# Altium schematic sheet TurboSpin.SchDoc
size A4; SheetNumber: 1; SheetTotal: 9
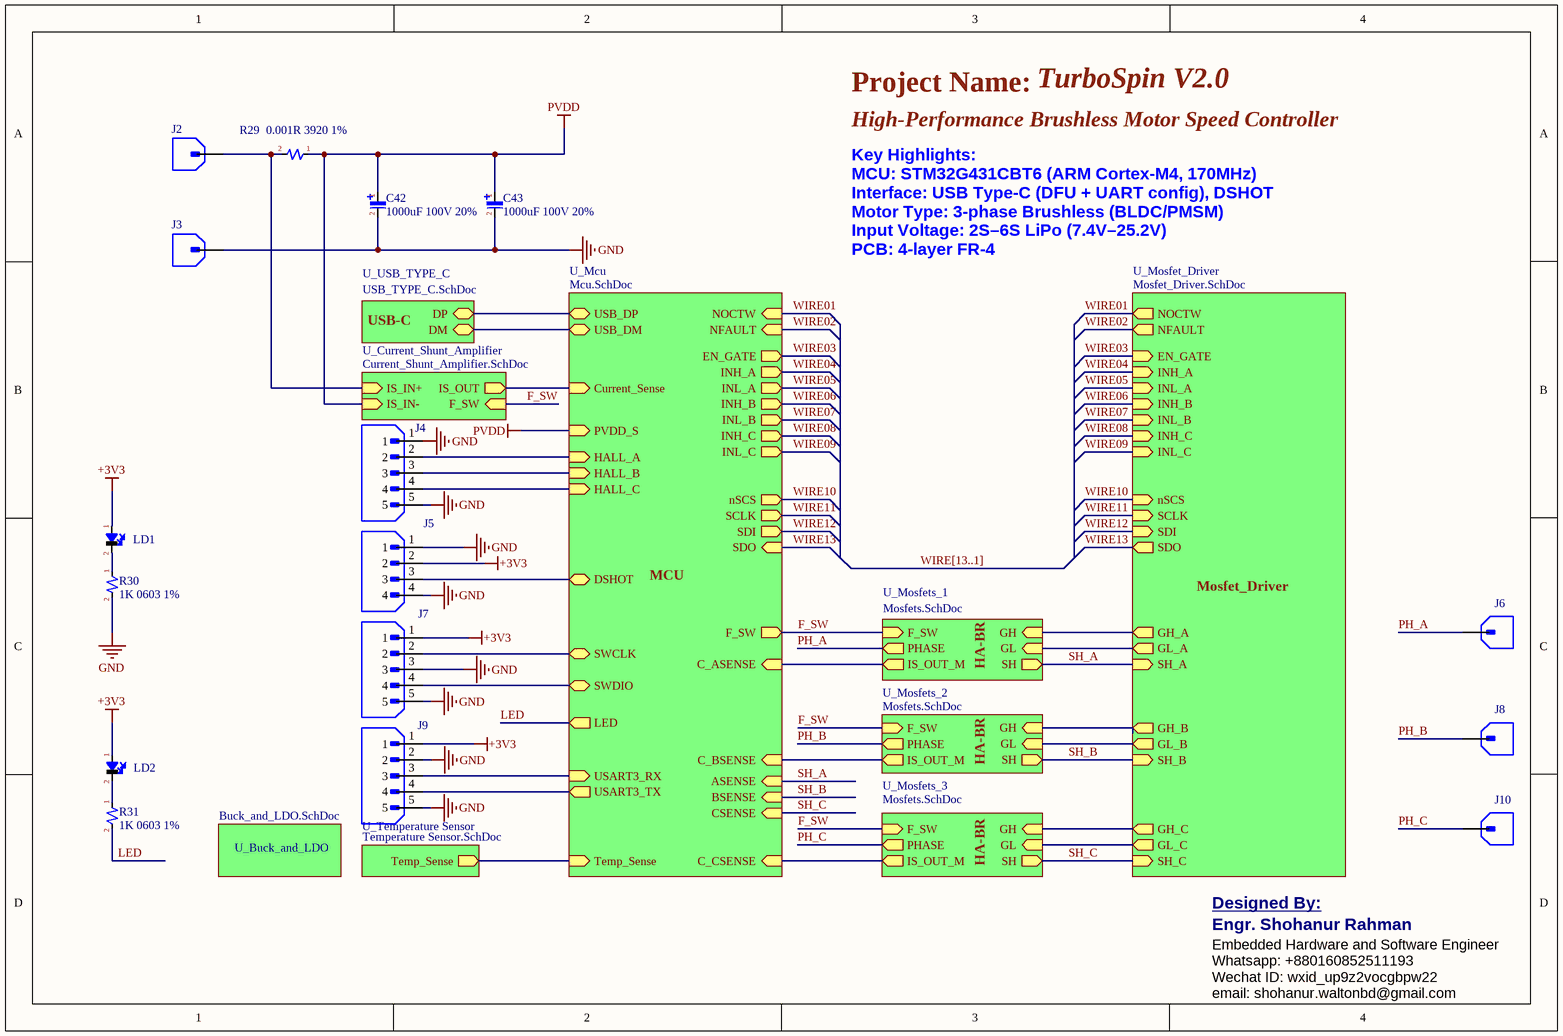
[diagram p0: TurboSpin.SchDoc]

## Parts
C42  1000uF 100V 20%  [C_RADIAL]
C43  1000uF 100V 20%  [C_RADIAL]
J2  Connector>>B1B  [CN_1P_PAD]  (value not drawn)
J3  Connector>>B1B  [CN_1P_PAD]  (value not drawn)
J4  Connector>>B5B-XH-A  [CN_HDGC2001WV-S-4]  (value not drawn)
J5  Connector>>B4B-XH-A  [CN_HDGC2001WV-S-3]  (value not drawn)
J6  Connector>>B1B  [CN_1P_PAD]  (value not drawn)
J7  Connector>>B5B-XH-A  [CN_HDGC2001WV-S-4]  (value not drawn)
J8  Connector>>B1B  [CN_1P_PAD]  (value not drawn)
J9  Connector>>B5B-XH-A  [CN_HDGC2001WV-S-4]  (value not drawn)
J10  Connector>>B1B  [CN_1P_PAD]  (value not drawn)
LD1  1.8Vf  25mA  5mW  [LED_0603_red]  (value not drawn)
LD2  1.8Vf  25mA  5mW  [LED_0603_red]  (value not drawn)
R29  0.001R 3920 1%  [R_3920]
R30  1K 0603 1%  [R_0603]
R31  1K 0603 1%  [R_0603]

## Sub-sheets
U_Buck_and_LDO = Buck_and_LDO.SchDoc: no entries
U_Current_Shunt_Amplifier = Current_Shunt_Amplifier.SchDoc: IS_OUT (out), IS_IN+ (in), IS_IN- (in), F_SW (in)
U_Mcu = Mcu.SchDoc: INH_C (out), INH_B (out), INH_A (out), INL_B (out), SCLK (out), SDI (out), INL_C (out), NOCTW (in), SDO (in), INL_A (out), nSCS (out), EN_GATE (out), USB_DP (bidir), USB_DM (bidir), C_ASENSE (in), C_BSENSE (in), C_CSENSE (in), Current_Sense (in), HALL_B (in), HALL_A (in), HALL_C (in), LED (out), ASENSE (in), BSENSE (in), CSENSE (in), PVDD_S (in), SWCLK (bidir), SWDIO (bidir), DSHOT (bidir), Temp_Sense (in), USART3_RX (in), USART3_TX (out), NFAULT (in), F_SW (out)
U_Mosfet_Driver = Mosfet_Driver.SchDoc: INL_B (in), INH_C (in), INL_C (in), INH_B (in), INL_A (in), INH_A (in), EN_GATE (in), SCLK (in), SDI (in), nSCS (in), SDO (out), GH_A (out), SH_A (in), GL_A (out), GH_B (out), SH_B (in), GL_B (out), GH_C (out), SH_C (in), GL_C (out), NOCTW (out), NFAULT (out)
U_Mosfets_1 = Mosfets.SchDoc: GH (in), PHASE (out), GL (in), SH (out), IS_OUT_M (out), F_SW (in)
U_Mosfets_2 = Mosfets.SchDoc: GH (in), PHASE (out), GL (in), SH (out), IS_OUT_M (out), F_SW (in)
U_Mosfets_3 = Mosfets.SchDoc: GH (in), PHASE (out), GL (in), SH (out), IS_OUT_M (out), F_SW (in)
U_Temperature Sensor = Temperature Sensor.SchDoc: Temp_Sense (out)
U_USB_TYPE_C = USB_TYPE_C.SchDoc: DP (bidir), DM (bidir)

## Nets
+3V3: J5.2 J7.1 J9.1 LD1.1(vdd) LD2.1(vdd)
GND: C42.2 C43.2 J3.1 J4.1 J4.5 J5.1 J5.4 J7.3 J7.5 J9.2 J9.5 R30.2
PVDD: C42.1 C43.1 R29.1 ; sheet U_Mcu/PVDD_S, sheet U_Current_Shunt_Amplifier/IS_IN-
F_SW: sheet U_Mosfets_2/F_SW, sheet U_Mosfets_1/F_SW, sheet U_Mosfets_3/F_SW, sheet U_Mcu/F_SW, sheet U_Current_Shunt_Amplifier/F_SW
LED: R31.2 ; sheet U_Mcu/LED
PH_A: J6.1 ; sheet U_Mosfets_1/PHASE
PH_B: J8.1 ; sheet U_Mosfets_2/PHASE
PH_C: J10.1 ; sheet U_Mosfets_3/PHASE
SH_A: sheet U_Mosfets_1/SH, sheet U_Mcu/ASENSE, sheet U_Mosfet_Driver/SH_A
SH_B: sheet U_Mosfets_2/SH, sheet U_Mcu/BSENSE, sheet U_Mosfet_Driver/SH_B
SH_C: sheet U_Mosfets_3/SH, sheet U_Mcu/CSENSE, sheet U_Mosfet_Driver/SH_C
WIRE01: sheet U_Mcu/NOCTW, sheet U_Mosfet_Driver/NOCTW
WIRE02: sheet U_Mcu/NFAULT, sheet U_Mosfet_Driver/NFAULT
WIRE03: sheet U_Mcu/EN_GATE, sheet U_Mosfet_Driver/EN_GATE
WIRE04: sheet U_Mcu/INH_A, sheet U_Mosfet_Driver/INH_A
WIRE05: sheet U_Mcu/INL_A, sheet U_Mosfet_Driver/INL_A
WIRE06: sheet U_Mcu/INH_B, sheet U_Mosfet_Driver/INH_B
WIRE07: sheet U_Mcu/INL_B, sheet U_Mosfet_Driver/INL_B
WIRE08: sheet U_Mcu/INH_C, sheet U_Mosfet_Driver/INH_C
WIRE09: sheet U_Mcu/INL_C, sheet U_Mosfet_Driver/INL_C
WIRE10: sheet U_Mcu/nSCS, sheet U_Mosfet_Driver/nSCS
WIRE11: sheet U_Mcu/SCLK, sheet U_Mosfet_Driver/SCLK
WIRE12: sheet U_Mcu/SDI, sheet U_Mosfet_Driver/SDI
WIRE13: sheet U_Mcu/SDO, sheet U_Mosfet_Driver/SDO
NetJ2_1: J2.1 R29.2 ; sheet U_Current_Shunt_Amplifier/IS_IN+
NetJ4_2: J4.2 ; sheet U_Mcu/HALL_A
NetJ4_3: J4.3 ; sheet U_Mcu/HALL_B
NetJ4_4: J4.4 ; sheet U_Mcu/HALL_C
NetJ5_3: J5.3 ; sheet U_Mcu/DSHOT
NetJ7_2: J7.2 ; sheet U_Mcu/SWCLK
NetJ7_4: J7.4 ; sheet U_Mcu/SWDIO
NetJ9_3: J9.3 ; sheet U_Mcu/USART3_RX
NetJ9_4: J9.4 ; sheet U_Mcu/USART3_TX
NetLD1_2: LD1.2(vss) R30.1
NetLD2_2: LD2.2(vss) R31.1
(unnamed): sheet U_Mosfets_2/GH, sheet U_Mosfet_Driver/GH_B
(unnamed): sheet U_Mosfets_2/GL, sheet U_Mosfet_Driver/GL_B
(unnamed): sheet U_Mosfets_2/IS_OUT_M, sheet U_Mcu/C_BSENSE
(unnamed): sheet U_Mosfets_1/GH, sheet U_Mosfet_Driver/GH_A
(unnamed): sheet U_Mosfets_1/GL, sheet U_Mosfet_Driver/GL_A
(unnamed): sheet U_Mosfets_1/IS_OUT_M, sheet U_Mcu/C_ASENSE
(unnamed): sheet U_Mosfets_3/GH, sheet U_Mosfet_Driver/GH_C
(unnamed): sheet U_Mosfets_3/GL, sheet U_Mosfet_Driver/GL_C
(unnamed): sheet U_Mosfets_3/IS_OUT_M, sheet U_Mcu/C_CSENSE
(unnamed): sheet U_Mcu/USB_DP, sheet U_USB_TYPE_C/DP
(unnamed): sheet U_Mcu/USB_DM, sheet U_USB_TYPE_C/DM
(unnamed): sheet U_Mcu/Current_Sense, sheet U_Current_Shunt_Amplifier/IS_OUT
(unnamed): sheet U_Mcu/Temp_Sense, sheet U_Temperature Sensor/Temp_Sense

## Buses and harness runs
bus WIRE[13..1]

## Notes on the sheet
- Project Name:
- TurboSpin V2.0
- High-Performance Brushless Motor Speed Controller
- Key Highlights:
  MCU: STM32G431CBT6 (ARM Cortex-M4, 170MHz)
  Interface: USB Type-C (DFU + UART config), DSHOT
  Motor Type: 3-phase Brushless (BLDC/PMSM)
  Input Voltage: 2S–6S LiPo (7.4V–25.2V)
  PCB: 4-layer FR-4
- USB-C
- MCU
- Mosfet_Driver
- HA-BR
- Designed By:
- Engr. Shohanur Rahman <https://www.linkedin.com/in/engr-shohanur-rahman-181a69250/>
- Embedded Hardware and Software Engineer
  Whatsapp: +880160852511193
  Wechat ID: wxid_up9z2vocgbpw22
  email: shohanur.waltonbd@gmail.com

## Library data of the parts
C42 C43 = Capacitor>> Polar
J2 J3 J6 J8 J10 = Connector>>B1B: Connector Header Through Hole 5 position 0.098 (2.50mm); MF: JST Sales; MP: B5B-XH-A; SnapEDA_Link: https://www.snapeda.com/parts/B5B-XH-A/JST+Sales+America+Inc./view-part/?ref=snap; Package: None; Value: *; Check_prices: https://www.snapeda.com/parts/B5B-XH-A/JST+Sales+America+Inc./view-part/?ref=eda
J4 J7 J9 = Connector>>B5B-XH-A: Connector Header Through Hole 5 position 0.098 (2.50mm); MF: JST Sales; SnapEDA_Link: https://www.snapeda.com/parts/B5B-XH-A/JST+Sales+America+Inc./view-part/?ref=snap; Package: None; Value: *; MP: B5B-XH-A; Check_prices: https://www.snapeda.com/parts/B5B-XH-A/JST+Sales+America+Inc./view-part/?ref=eda
J5 = Connector>>B4B-XH-A: Connector Header Through Hole 5 position 0.098 (2.50mm); MF: JST Sales; MP: B5B-XH-A; SnapEDA_Link: https://www.snapeda.com/parts/B5B-XH-A/JST+Sales+America+Inc./view-part/?ref=snap; Package: None; Value: *; Check_prices: https://www.snapeda.com/parts/B5B-XH-A/JST+Sales+America+Inc./view-part/?ref=eda
LD1 LD2 = LED>> General Purpose
R29-R31 = Resistor>> General Purpose: RES 0603 20%